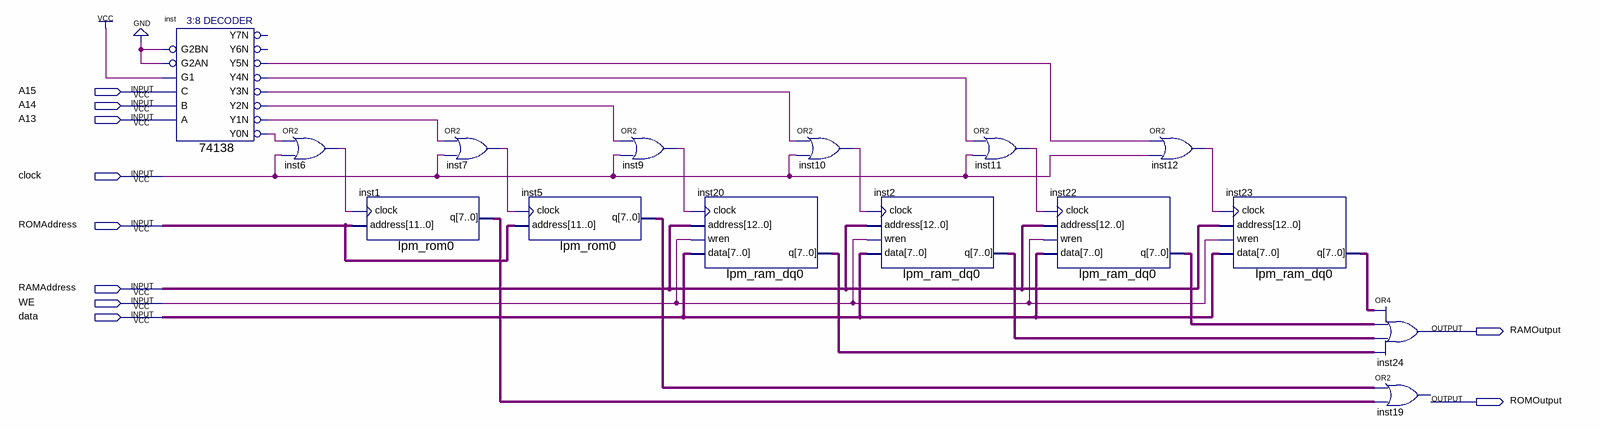
[diagram p0: schematic sheet]
// Quartus schematic BuildRom.bdf as structural Verilog: 15 symbols, 10 pins
module BuildRom (
  input  A15,
  input  A14,
  input  A13,
  input  clock,
  input  ROMAddress,
  input  RAMAddress,
  input  WE,
  input  data,
  output RAMOutput,
  output ROMOutput
);

  wire inst6_out, inst7_out, inst9_out, inst10_out, inst11_out, inst12_out, inst_y0n, inst_y1n, inst_y2n,
       inst_y3n, inst_y4n, inst_y5n;
  wire [7:0] inst1_q, inst2_q, inst5_q, inst20_q, inst22_q, inst23_q, undriven_2;
  wire [11:0] undriven;
  wire [12:0] undriven_3;

  \74138  inst (
    .A(A13), .B(A14), .G1(1'b1), .C(A15), .G2AN(1'b0), .G2BN(1'b0), .Y0N(inst_y0n), .Y1N(inst_y1n),
    .Y2N(inst_y2n), .Y3N(inst_y3n), .Y4N(inst_y4n), .Y5N(inst_y5n));  // open: Y6N, Y7N
  or inst6 (inst6_out, inst_y0n, clock);
  lpm_rom0 inst1 (.address(undriven), .clock(inst6_out), .q(inst1_q));
  or inst7 (inst7_out, inst_y1n, clock);
  lpm_rom0 inst5 (.address(undriven), .clock(inst7_out), .q(inst5_q));
  or inst9 (inst9_out, inst_y2n, clock);
  lpm_ram_dq0 inst20 (.data(undriven_2), .wren(WE), .address(undriven_3), .clock(inst9_out), .q(inst20_q));
  or inst10 (inst10_out, inst_y3n, clock);
  lpm_ram_dq0 inst2 (.data(undriven_2), .wren(WE), .address(undriven_3), .clock(inst10_out), .q(inst2_q));
  or inst11 (inst11_out, inst_y4n, clock);
  lpm_ram_dq0 inst22 (.data(undriven_2), .wren(WE), .address(undriven_3), .clock(inst11_out), .q(inst22_q));
  or inst12 (inst12_out, inst_y5n, clock);
  lpm_ram_dq0 inst23 (.data(undriven_2), .wren(WE), .address(undriven_3), .clock(inst12_out), .q(inst23_q));
  assign RAMOutput = inst23_q | inst22_q | inst2_q | inst20_q;  // OR4 inst24, 8 bits wide
  // OR2 inst19 has open pins: IN1=inst5_q, IN2=inst1_q, OUT=open
endmodule
